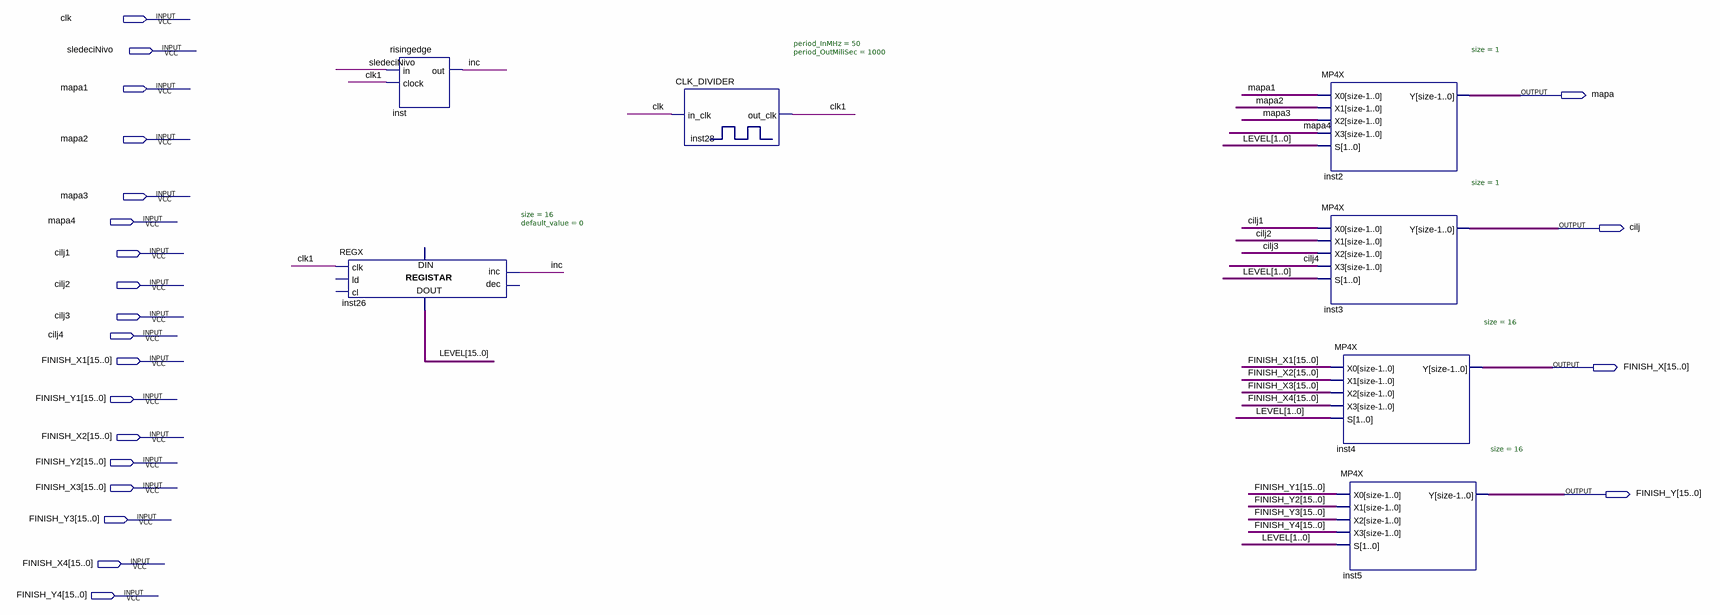
[diagram p0: schematic sheet]
// Quartus schematic multiplekseri.bdf as structural Verilog: 7 symbols, 22 pins
module multiplekseri (
  input  clk,
  input  sledeciNivo,
  input  mapa1,
  input  mapa2,
  input  mapa3,
  input  mapa4,
  input  cilj1,
  input  cilj2,
  input  cilj3,
  input  cilj4,
  input  [15:0] FINISH_X1,
  input  [15:0] FINISH_Y1,
  input  [15:0] FINISH_X2,
  input  [15:0] FINISH_Y2,
  input  [15:0] FINISH_X3,
  input  [15:0] FINISH_Y3,
  input  [15:0] FINISH_X4,
  input  [15:0] FINISH_Y4,
  output mapa,
  output cilj,
  output [15:0] FINISH_X,
  output [15:0] FINISH_Y
);

  wire clk1, inc;
  wire [15:0] LEVEL;

  REGX #(.size(16), .default_value(0)) inst26 (.clk(clk1), .inc(inc), .data_out(LEVEL));  // open: ld, cl, dec, data_in
  risingedge inst (.in(sledeciNivo), .clock(clk1), .out(inc));
  CLK_DIVIDER #(.period_InMHz(50), .period_OutMiliSec(1000)) inst28 (.in_clk(clk), .out_clk(clk1));
  MP4X #(.size(1)) inst2 (.X0(mapa1), .X1(mapa2), .X2(mapa3), .X3(mapa4), .S(LEVEL[1:0]), .Y(mapa));
  MP4X #(.size(1)) inst3 (.X0(cilj1), .X1(cilj2), .X2(cilj3), .X3(cilj4), .S(LEVEL[1:0]), .Y(cilj));
  MP4X #(.size(16)) inst4 (
    .X0(FINISH_X1), .X1(FINISH_X2), .X2(FINISH_X3), .X3(FINISH_X4), .S(LEVEL[1:0]), .Y(FINISH_X));
  MP4X #(.size(16)) inst5 (
    .X0(FINISH_Y1), .X1(FINISH_Y2), .X2(FINISH_Y3), .X3(FINISH_Y4), .S(LEVEL[1:0]), .Y(FINISH_Y));
endmodule
